# Altium schematic sheet Power.SchDoc: Power Supply and Regulator Module
size A4; DocumentNumber: 2; SheetNumber: 2; SheetTotal: 16
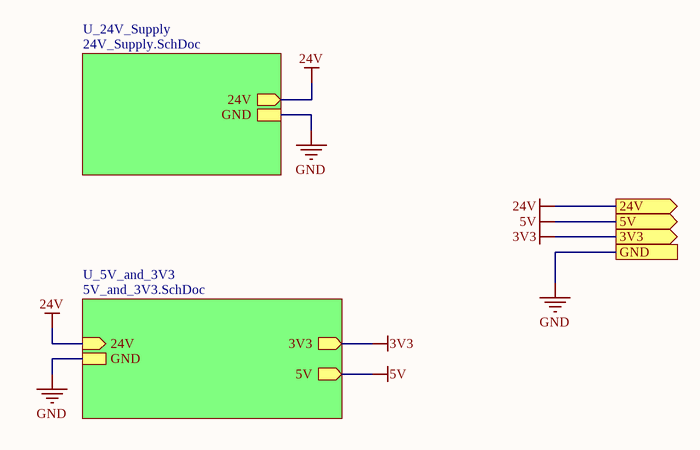
[diagram p0: Power.SchDoc]

## Sub-sheets
U_5V_and_3V3 = 5V_and_3V3.SchDoc: 24V (in), GND, 3V3 (out), 5V (out)
U_24V_Supply = 24V_Supply.SchDoc: 24V (out), GND

## Ports
3V3 (out), 5V (out), 24V (out), GND

## Nets
3V3: port 3V3, sheet U_5V_and_3V3/3V3
5V: port 5V, sheet U_5V_and_3V3/5V
24V: port 24V, sheet U_24V_Supply/24V, sheet U_5V_and_3V3/24V
GND: port GND, sheet U_24V_Supply/GND, sheet U_5V_and_3V3/GND

## Notes on the sheet
- Title
- FileName:
- Version:
- Date:
- Project
- Designed By:
- Descriptions:
- Sheet:
- of